# EAGLE design module (EAGLE 9.4.0)
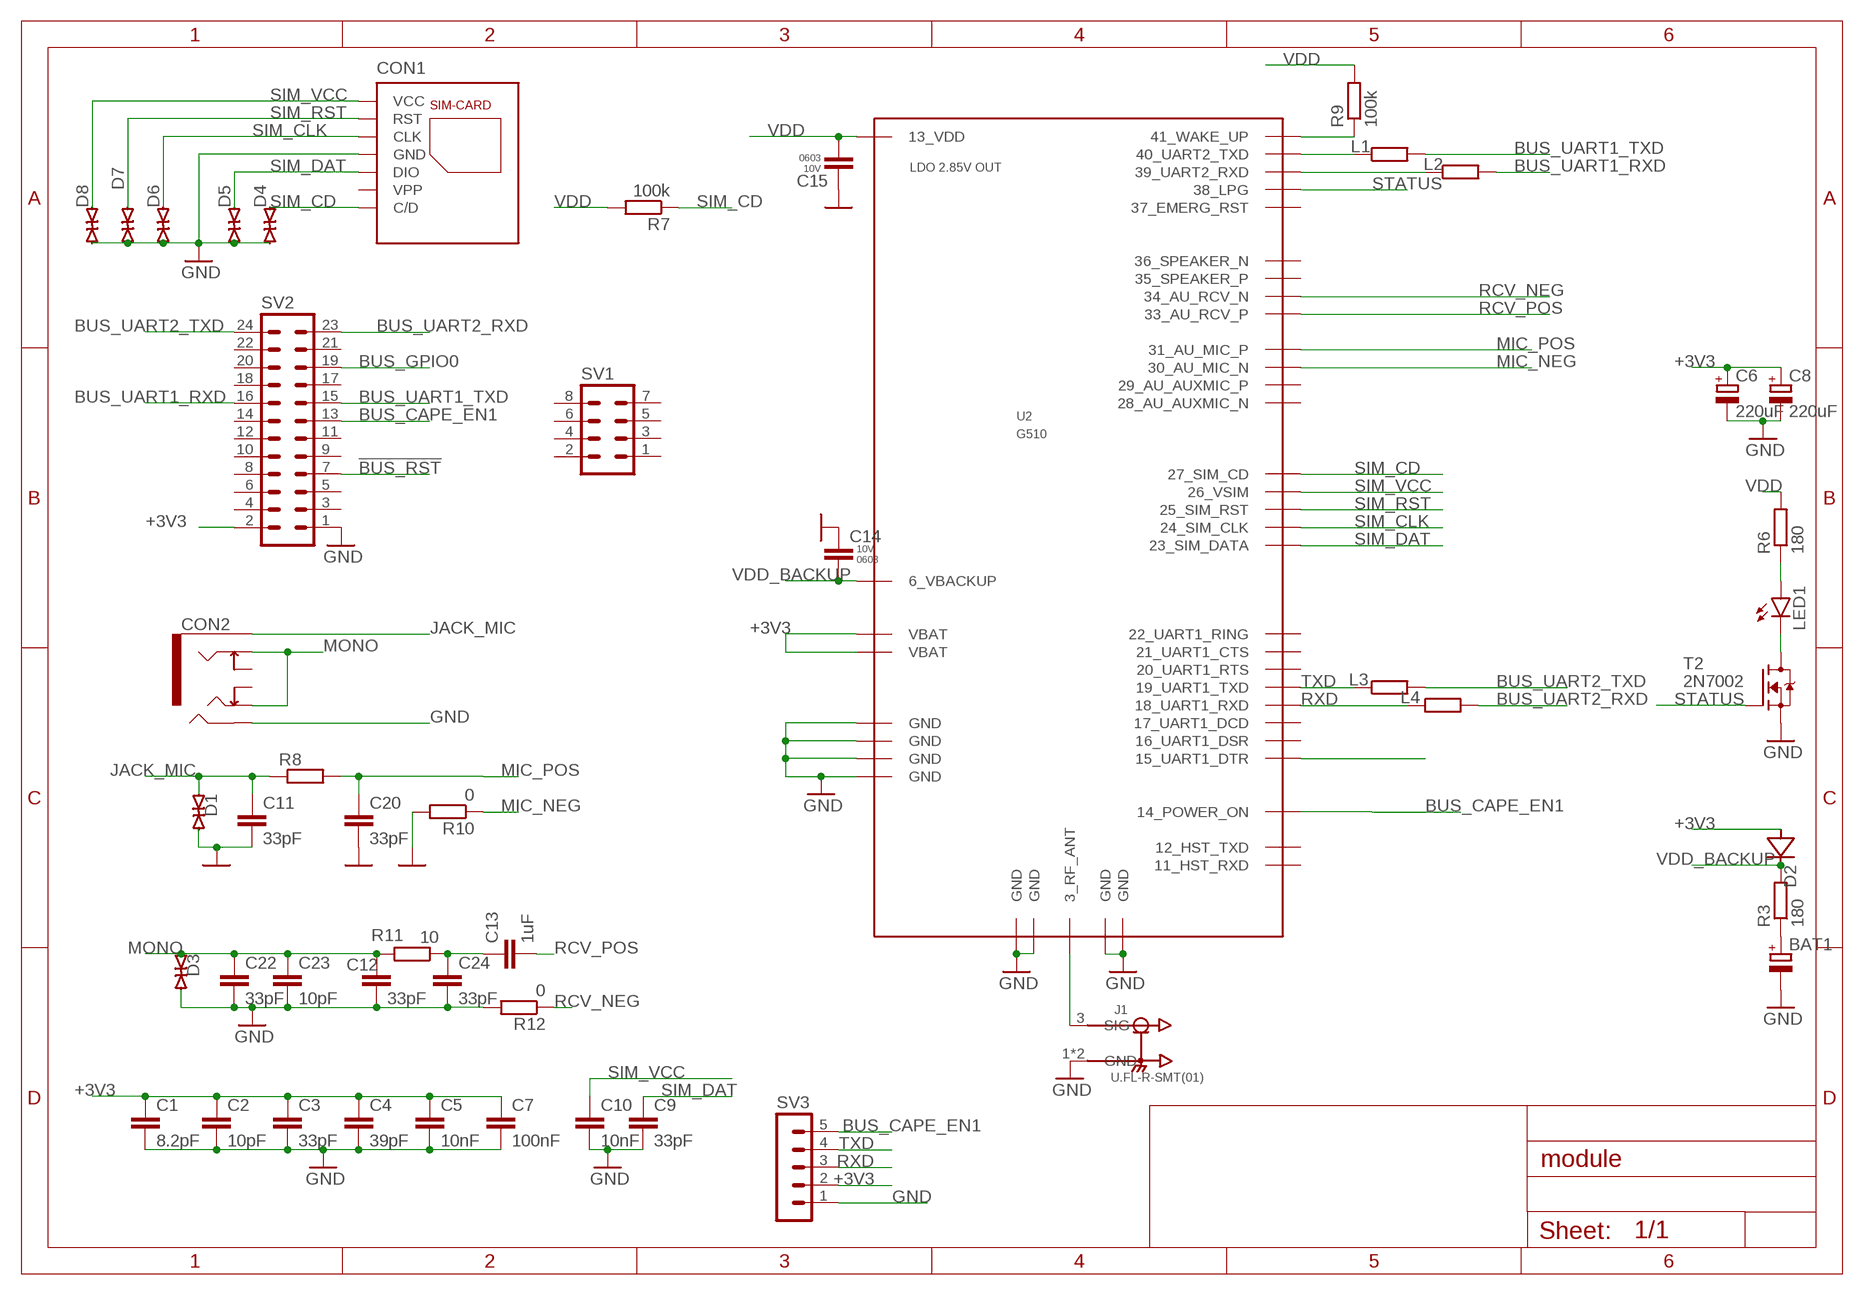
[diagram p0: schematic, sheet 1]

## Parts
BAT1  DCK-3R3E224U-E  [621]
C1  8.2pF  CAP-0402  [C0402K]
C2  10pF  CAP-0402  [C0402K]
C3  33pF  CAP-0402  [C0402K]
C4  39pF  CAP-0402  [C0402K]
C5  10nF  C-EUC0603  [C0603]
C6  220uF  CAP-POL-SMC  [SMC_C]
C7  100nF  C-EUC0603  [C0603]
C8  220uF  CAP-POL-SMC  [SMC_C]
C9  33pF  CAP-0603  [C0603]
C10  10nF  CAP-0603  [C0603]
C11  33pF  CAP-0402  [C0402K]
C12  33pF  CAP-0402  [C0402K]
C13  1uF  CAP-0402  [C0402K]
C14  CAP-0603  [C0603]
C15  CAP-0603  [C0603]
C20  33pF  CAP-0402  [C0402K]
C22  33pF  CAP-0402  [C0402K]
C23  10pF  CAP-0402  [C0402K]
C24  33pF  CAP-0402  [C0402K]
CON1  115Q-BCA0  [115Q]
CON2  1503-21  [150321]
D1  ESD9B5.0ST5G  [SOD1006X40]
D2  1N4148WS  [SOD323]
D3  ESD9B5.0ST5G  [SOD1006X40]
D4  ESD9B5.0ST5G  [SOD1006X40]
D5  ESD9B5.0ST5G  [SOD1006X40]
D6  ESD9B5.0ST5G  [SOD1006X40]
D7  ESD9B5.0ST5G  [SOD1006X40]
D8  ESD9B5.0ST5G  [SOD1006X40]
J1  U.FL-R-SMT(01)  [HRS_U.FL-R-SMT(01)]
L1  RES-0603  [R0603]
L2  RES-0603  [R0603]
L3  RES-0603  [R0603]
L4  RES-0603  [R0603]
LED1  LEDCHIP-LED0603  [CHIP-LED0603]
R3  180  RES-0603  [R0603]
R6  180  RES-0603  [R0603]
R7  100k  RES-0603  [R0603]
R8  R-EU_R0402  [R0402]
R9  100k  RES-0603  [R0603]
R10  0  R-EU_R0402  [R0402]
R11  10  R-EU_R0402  [R0402]
R12  0  R-EU_R0402  [R0402]
SV1  MA04-2  [MA04-2]
SV2  MA12-2  [MA12-2]
SV3  MA05-1  [MA05-1]
T2  2N7002  [SOT95P240X110-3]
U2  G510  [G510]

## Nets
!BUS_RST: SV2.7
+3V3: C1.1 C2.1 C3.1 C4.1 C5.1 C6.+ C7.1 C8.+ D2.A SV2.2 SV3.2 U2.9_VBAT(VBAT) U2.10_VBAT(VBAT)
BUS_CAPE_EN1: SV2.13 SV3.5 U2.14_POWER_ON
BUS_GPIO0: SV2.19
BUS_UART1_RXD: L2.2 SV2.16
BUS_UART1_TXD: L1.2 SV2.15
BUS_UART2_RXD: L4.2 SV2.23
BUS_UART2_TXD: L3.2 SV2.24
GND: BAT1.- C1.2 C2.2 C3.2 C4.2 C5.2 C6.- C7.2 C8.- C9.2 C10.2 C11.2 C12.2 C14.1 C15.1 C20.2 C22.2 C23.2 C24.2 CON1.GND1(GND) CON1.GND2(GND) CON1.GND3(GND) CON1.GND4(GND) CON1.P5(GND) CON2.2 D1.2(C) D3.2(C) D4.1(A) D5.1(A) D6.1(A) D7.1(A) D8.1(A) J1.1(GND) J1.2(GND) R10.2 R12.2 SV2.1 SV3.1 T2.2(S) U2.1_GND(GND) U2.2_GND(GND) U2.4_GND(GND) U2.5_GND(GND) U2.7_GND(GND) U2.8_GND(GND) U2.32_GND(GND) U2.42_GND(GND)
JACK_MIC: C11.1 CON2.1 D1.1(A) R8.1
MIC_NEG: R10.1 U2.30_AU_MIC_N
MIC_POS: C20.1 R8.2 U2.31_AU_MIC_P
MONO: C12.1 C22.1 C23.1 CON2.3 CON2.5 D3.1(A) R11.2
N$1: BAT1.+ R3.1
N$3: C13.1 C24.1 R11.1
N$4: J1.3(SIG) U2.3_RF_ANT
N$5: U2.15_UART1_DTR
N$6: LED1.C T2.3(D)
N$7: R9.1 U2.41_WAKE_UP
N$12: LED1.A R6.1
RCV_NEG: R12.1 U2.34_AU_RCV_N
RCV_POS: C13.2 U2.33_AU_RCV_P
RXD: L4.1 SV3.3 U2.18_UART1_RXD
SIM_CD: CON1.CD(C/D) D4.2(C) R7.1 U2.27_SIM_CD
SIM_CLK: CON1.P3(CLK) D6.2(C) U2.24_SIM_CLK
SIM_DAT: C9.1 CON1.P7(DIO) D5.2(C) U2.23_SIM_DATA
SIM_RST: CON1.P2(RST) D7.2(C) U2.25_SIM_RST
SIM_VCC: C10.1 CON1.P1(VCC) D8.2(C) U2.26_VSIM
STATUS: T2.1(G) U2.38_LPG
TXD: L3.1 SV3.4 U2.19_UART1_TXD
UART_RXD: L2.1 U2.39_UART2_RXD
UART_TXD: L1.1 U2.40_UART2_TXD
VDD: C15.2 R6.2 R7.2 R9.2 U2.13_VDD
VDD_BACKUP: C14.2 D2.K(C) R3.2 U2.6_VBACKUP
Unconnected: CON1.P6(VPP) CON2.4 CON2.6 SV1.1 SV1.2 SV1.3 SV1.4 SV1.5 SV1.6 SV1.7 SV1.8 SV2.3 SV2.4 SV2.5 SV2.6 SV2.8 SV2.9 SV2.10 SV2.11 SV2.12 SV2.14 SV2.17 SV2.18 SV2.20 SV2.21 SV2.22 U2.11_HSTRXD(11_HST_RXD) U2.12_HST_TXD U2.16_UART1_DSR U2.17_UART1_DCD U2.20_UART1_RTS U2.21_UART1_CTS U2.22_UART1_RING U2.28_AU_AUXMIC_N U2.29_AU_AUXMIC_P U2.35_SPEAKER_P U2.36_SPEAKER_N U2.37_EMERG_RST

## Library data of the parts
BAT1 = parts-elna:DCK-3R3E224U-E
C1-C4 C11-C13 C20 C22-C24 = parts-passives:CAP-; PACKAGE: 0402; RATING: 6V
C5 C7 = rcl:C-EU: CAPACITOR, European symbol; SPICEPREFIX: C
C6 C8 = parts-passives:CAP-POL-; PACKAGE: SMC; RATING: 6V
C9 C10 C14 C15 = parts-passives:CAP-; PACKAGE: 0603; RATING: 10V
CON1 = parts-attend:115Q-BCA0
CON2 = parts-lumberg:1503-21
D1 D3-D8 = parts-onsemi:ESD9B
D2 = parts-diotec:1N4148WS
J1 = parts-molex:U.FL-R-SMT(01): U.FL Series 6 Ghz 50 Ohm Ultra-small SMT Coaxial Cable Receptacle; AVAILABILITY: Unavailable; DESCRIPTION: U.FL Series 6 Ghz 50 Ohm Ultra-small SMT Coaxial Cable Receptacle; MF: Hirose; MP: U.FL-R-SMT_01_; PACKAGE: None; PRICE: None
L1-L4 R3 R6 R7 R9 = parts-passives:RES-; PACKAGE: 0603
LED1 = led:LED: LED OSRAM: - CHIPLED LG R971, LG N971, LY N971, LG Q971, LY Q971, LO R971, LY R971 LH N974, LH R974 LS Q976, LO Q976, LY Q976 LO Q996 - Hyper CHIPLED LW Q18S LB Q993, LB Q99A, LB R99A - SideLED LS A670, LO A670, LY A670, LG A670, LP A670 LB A673, LV A673, LT A673, LW A673 LH A674 LY A675 LS A676, LA A676, LO A676, LY A676, LW A676 LS A679, LY A679, LG A679 - Hyper Micro SIDELED® LS Y876, LA Y876, LO Y876, LY Y876 LT Y87S - SmartLED LW L88C, LW L88S LB L89C, LB L89S, LG L890 LS L89K, LO L89K, LY L89K LS L896, LA L896, LO L896, LY L896 - TOPLED LS T670, LO T670, LY T670, LG T670, LP T670 LSG T670, LSP T670, LSY T670, LOP T670, LYG T670 LG T671, LOG T671, LSG T671 LB T673, LV T673, LT T673, LW T673 LH T674 LS T676, LA T676, LO T676, LY T676, LB T676, LH T676, LSB T676, LW T676 LB T67C, LV T67C, LT T67C, LS T67K, LO T67K, LY T67K, LW E67C LS E67B, LA E67B, LO E67B, LY E67B, LB E67C, LV E67C, LT E67C LW T67C LS T679, LY T679, LG T679 LS T770, LO T770, LY T770, LG T770, LP T770 LB T773, LV T773, LT T773, LW T773 LH T774 LS E675, LA E675, LY E675, LS T675 LS T776, LA T776, LO T776, LY T776, LB T776 LHGB T686 LT T68C, LB T68C - Hyper Mini TOPLED® LB M676 - Mini TOPLED Santana® LG M470 LS M47K, LO M47K, LY M47K Source: http://www.osram.convergy.de LUXEON: - LUMILED® LXK2-PW12-R00, LXK2-PW12-S00, LXK2-PW14-U00, LXK2-PW14-V00 LXK2-PM12-R00, LXK2-PM12-S00, LXK2-PM14-U00 LXK2-PE12-Q00, LXK2-PE12-R00, LXK2-PE12-S00, LXK2-PE14-T00, LXK2-PE14-U00 LXK2-PB12-K00, LXK2-PB12-L00, LXK2-PB12-M00, LXK2-PB14-N00, LXK2-PB14-P00, LXK2-PB14-Q00 LXK2-PR12-L00, LXK2-PR12-M00, LXK2-PR14-Q00, LXK2-PR14-R00 LXK2-PD12-Q00, LXK2-PD12-R00, LXK2-PD12-S00 LXK2-PH12-R00, LXK2-PH12-S00 LXK2-PL12-P00, LXK2-PL12-Q00, LXK2-PL12-R00 Source: www.luxeon.com KINGBRIGHT: KA-3528ASYC Source: www.kingbright.com
R8 R10-R12 = rcl:R-EU_: RESISTOR, European symbol; SPICEPREFIX: R
SV1 = con-lstb:MA04-2: PIN HEADER; OC_FARNELL: unknown; OC_NEWARK: unknown
SV2 = con-lstb:MA12-2: PIN HEADER; OC_FARNELL: unknown; OC_NEWARK: unknown
SV3 = parts-passives:MA05-1: PIN HEADER; OC_FARNELL: unknown; OC_NEWARK: unknown
T2 = parts-onsemi:2N7002
U2 = parts-fibocom:G510

## Net classes
1 50_feed: width 1 mm, clearance 0.4 mm
2 usb_dif: width 0.4 mm, clearance 0.8 mm

## Board
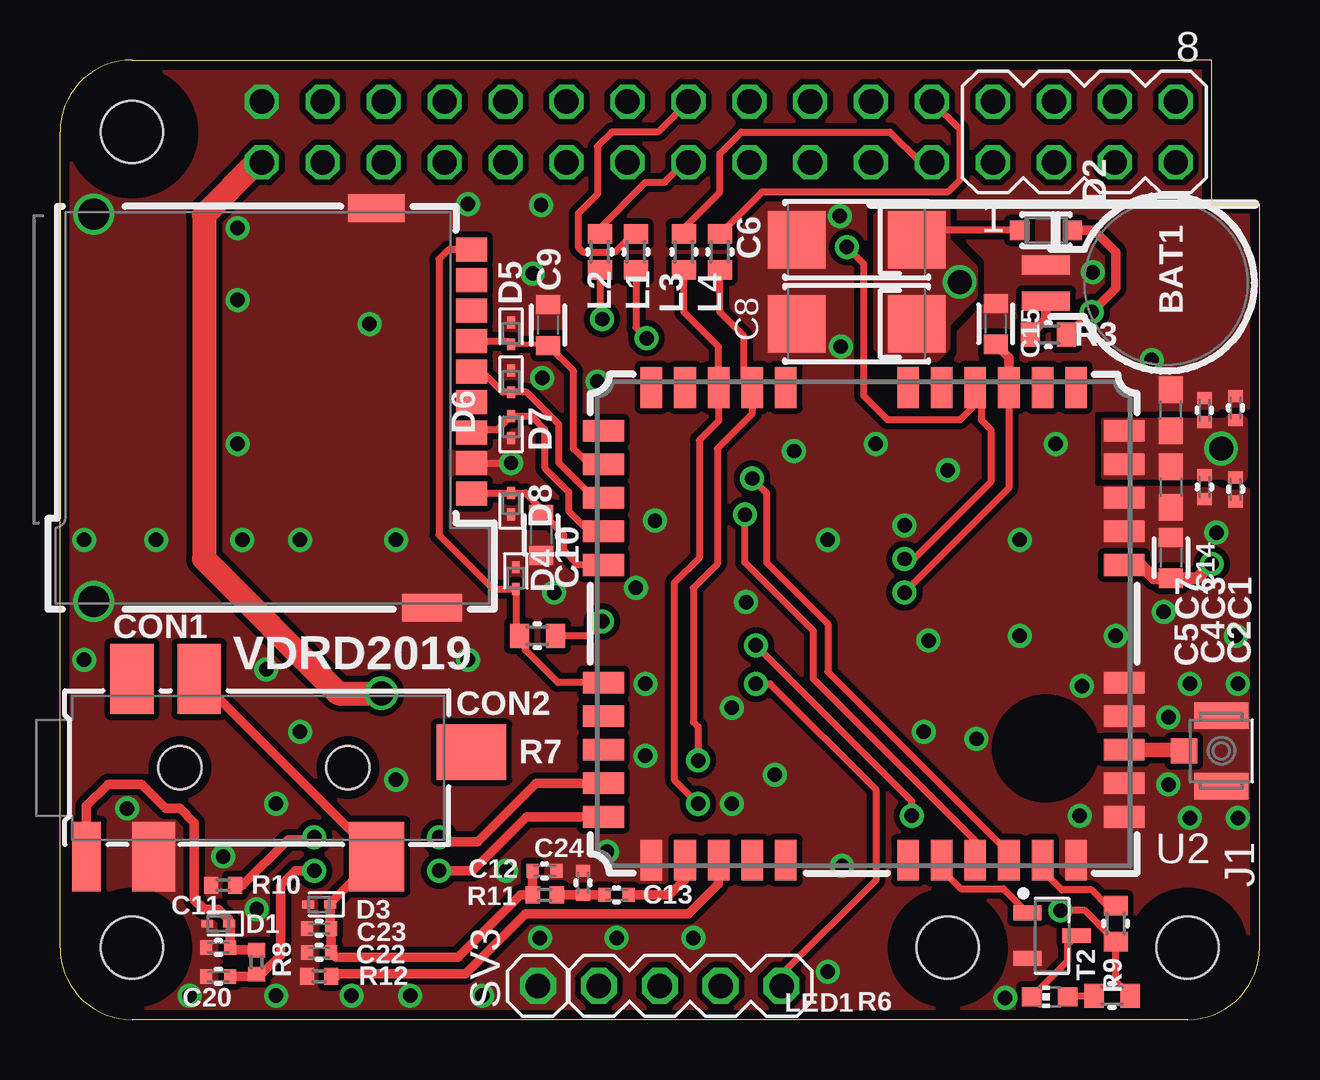
[diagram p1: board, top side]
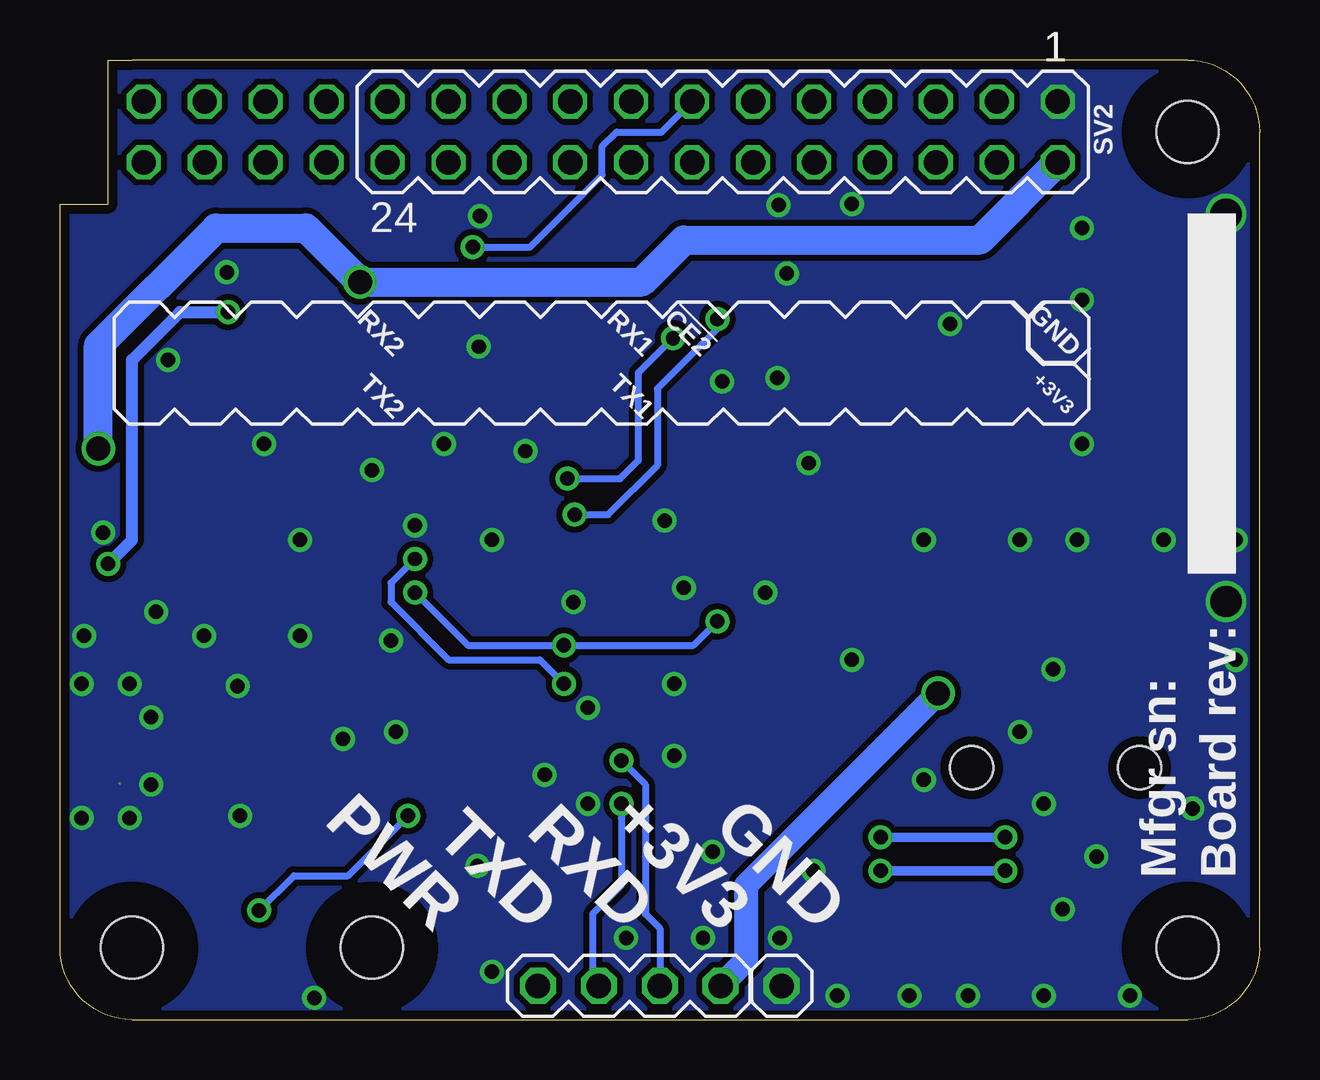
[diagram p2: board, bottom side, seen from below]

Size 50 x 40 mm. Coordinates in mm from the lower left corner, seen from the top.
Outline: 3,40 47,40 48,40 48,34 50,34 50,3 arc-90 47,0 3,0 arc-90 0,3 0,37 arc-90 3,40
Copper layers (1*16): Top 0.035mm / dielectric 0.93mm / Bottom 0.035mm
Design rules "default *": minimum track width 0.2mm, minimum drill 0.3mm, track to track 0.2mm, track to pad 0.2mm, pad to pad 0.2mm, via to via 0.2mm, smd to smd 6mil, copper to edge 0.4mm, drill to drill 0.2mm, minimum pad ring 0.2mm, minimum via ring 0.2mm, stop-mask expansion 0.1mm, vias tented up to drill 0.6mm, thermal gap 10mil
Holes 2.6 mm at 3,37 3,3 37,3 47,3
tRestrict: area 0.5,34.5 to 5.5,39.5; area 0.8,0.8 to 5.2,5.2; area 34.8,0.8 to 39.2,5.2; area 44.8,0.8 to 49.2,5.2
bRestrict: area 0.5,34.5 to 5.5,39.5; area 0.5,0.5 to 5.5,5.5; area 34.5,0.5 to 39.5,5.5; area 44.5,0.5 to 49.5,5.5

### Footprints (pad centres in the part's own frame; a part is rotated, then mirrored left to right if it is on the bottom)
621 = smd 0.8 x 2: + 0.75,-1.6; - -0.75,-1.6
C0402K = smd 0.5 x 0.6: 1 -0.5,0; 2 0.5,0
C0603 = smd 1.1 x 1: 1 -0.85,0; 2 0.85,0
SMC_C = smd 2.4 x 2.4: + -2.5,0; - 2.5,0
C0603' = smd 0.8 x 1: 1 -0.85,0; 2 0.85,0
115Q = smd 1 x 1.3: CD -6.59,0.65; P1 3.57,0.65; P2 1.03,0.65; P3 -1.51,0.65; P4 -4.05,0.65; P5 2.3,0.65; P6 -0.24,0.65; P7 -2.78,0.65; P8 -5.32,0.65 | smd 1.15 x 2.35: GND1 -8.325,-3.32 | smd 1.15 x 2.5: GND2 8.325,-1 | drill 1.3: GND3 -8.07,-15.1; GND4 8.07,-15.1
150321 = smd 1.2 x 2.9: 1 3.9,3.7 | smd 1.8 x 2.9: 2 1.1,3.7; 5 -0.8,-3.7; 6 2,-3.7 | smd 2.3 x 2.9: 3 -8.2,3.7 | smd 2.9 x 2.3: 4 -12.15,-0.65 | hole 1.8: 0,0; -7,0
SOD1006X40 = smd 0.495 x 0.32: 1 -0.453,0; 2 0.453,0
SOD323 = smd 0.8 x 0.8: A 1.1,0; K -1.1,0
HRS_U.FL-R-SMT(01) = smd 1.1 x 2.25: 1 -1.475,0; 2 1.475,0 | smd 1.05 x 1.1: 3 0,-1.55
R0603 = smd 0.8 x 1: 1 -0.75,0; 2 0.75,0
CHIP-LED0603 = smd 0.8 x 0.8: A 0,-0.75; C 0,0.75
R0402 = smd 0.6 x 0.7: 1 -0.5,0; 2 0.5,0
MA04-2 = drill 1.016 octagon: 1 -3.81,-1.27; 2 -3.81,1.27; 3 -1.27,-1.27; 4 -1.27,1.27; 5 1.27,-1.27; 6 1.27,1.27; 7 3.81,-1.27; 8 3.81,1.27
MA12-2 = drill 1.016 octagon: 1 -13.97,-1.27; 2 -13.97,1.27; 3 -11.43,-1.27; 4 -11.43,1.27; 5 -8.89,-1.27; 6 -8.89,1.27; 7 -6.35,-1.27; 8 -6.35,1.27; 9 -3.81,-1.27; 10 -3.81,1.27; 11 -1.27,-1.27; 12 -1.27,1.27; 13 1.27,-1.27; 14 1.27,1.27; 15 3.81,-1.27; 16 3.81,1.27; 17 6.35,-1.27; 18 6.35,1.27; 19 8.89,-1.27; 20 8.89,1.27; 21 11.43,-1.27; 22 11.43,1.27; 23 13.97,-1.27; 24 13.97,1.27
MA05-1 = drill 1.016 pad 1.5 octagon: 1 -5.08,0; 2 -2.54,0; 3 0,0; 4 2.54,0; 5 5.08,0
SOT95P240X110-3 = smd 1.18 x 0.609: 1 -1.024,0.95; 2 -1.024,-0.95; 3 1.024,0
G510 = smd 0.9 x 1.7: 1_GND -8.05,-10.85; 2_GND -6.65,-10.85; 3_RF_ANT -5.25,-10.85; 4_GND -3.85,-10.85; 5_GND -2.45,-10.85; 6_VBACKUP 2.45,-10.85; 7_GND 3.85,-10.85; 8_GND 5.25,-10.85; 9_VBAT 6.65,-10.85; 10_VBAT 8.05,-10.85; 22_UART1_RING 8.05,10.85; 23_SIM_DATA 6.65,10.85; 24_SIM_CLK 5.25,10.85; 25_SIM_RST 3.85,10.85; 26_VSIM 2.45,10.85; 27_SIM_CD -2.45,10.85; 28_AU_AUXMIC_N -3.85,10.85; 29_AU_AUXMIC_P -5.25,10.85; 30_AU_MIC_N -6.65,10.85; 31_AU_MIC_P -8.05,10.85 | smd 1.7 x 0.9: 11_HSTRXD 9.85,-8.85; 12_HST_TXD 9.85,-7.45; 13_VDD 9.85,-6.05; 14_POWER_ON 9.85,-4.65; 15_UART1_DTR 9.85,-3.25; 16_UART1_DSR 9.85,-1.85; 17_UART1_DCD 9.85,3.25; 18_UART1_RXD 9.85,4.65; 19_UART1_TXD 9.85,6.05; 20_UART1_RTS 9.85,7.45; 21_UART1_CTS 9.85,8.85; 32_GND -9.85,8.85; 33_AU_RCV_P -9.85,7.45; 34_AU_RCV_N -9.85,6.05; 35_SPEAKER_P -9.85,4.65; 36_SPEAKER_N -9.85,3.25; 37_EMERG_RST -9.85,-1.85; 38_LPG -9.85,-3.25; 39_UART2_RXD -9.85,-4.65; 40_UART2_TXD -9.85,-6.05; 41_WAKE_UP -9.85,-7.45; 42_GND -9.85,-8.85

### Placement (x,y rotation side)
BAT1  42.7,30.7 270 top
C1  49,25.5 90 top
C2  49,22.1 270 top
C3  47.7,25.4 90 top
C4  47.7,22.2 270 top
C5  46.3,22.2 270 top
C6  33.2,32.5 180 top
C7  46.3,25.4 90 top
C8  33.2,29 180 top
C9  33pF  [C0603']  20.35,28.95 90 top
C10  10nF  [C0603']  20.05,20.2 270 top
C11  6.6,3 180 top
C12  20.2,6.2 0 top
C13  23.2,5.2 0 top
C14  [C0603']  46.3,19.25 270 top
C15  [C0603']  39,29 270 top
C20  6.6,1.8 180 top
C22  10.8,2.8 180 top
C23  10.8,3.8 180 top
C24  21.8,5.7 90 top
CON1  16.5,25.5 270 top
CON2  5,10.5 180 top
D1  6.6,4 180 top
D2  41.1,32.9 180 top
D3  10.8,4.8 180 top
D4  19,18.4 270 top
D5  18.8,28.6 270 top
D6  18.8,26.6 270 top
D7  18.8,24.7 90 top
D8  18.8,21.5 90 top
J1  48.4,11.2 270 top
L1  24,32 90 top
L2  22.5,32 90 top
L3  26,32 90 top
L4  27.5,32 90 top
LED1  41.25,0.95 90 top
R3  41.2,28.55 0 top
R6  43.85,1 0 top
R7  19.9,16 0 top
R8  8.2,2.4 270 top
R9  44,4 270 top
R10  6.8,5.6 180 top
R11  20.2,5.2 180 top
R12  10.8,1.8 180 top
SV1  42.7,37 0 top
SV2  22.38,37 180 bottom
SV3  25,1.4 0 top
T2  41.35,3.5 0 top
U2  33.5,16.5 90 top

### Tracks (layer width: path | path; a pad name or v marks a point on that pad's centre or on a via)
+3V3  (via drill 1)
  Top 0.3: D2.A 36.1,32.9 C6.+
  Top 1: SV2.2 8.2,35.73 6,33.53 6,19.2 11.6,13.6 v13.4,13.6
  Bottom 1: v13.4,13.6 21.4,5.6 21.4,2.46 SV3.2
  Bottom 1.2: v48.4,23.8 48.4,28.1 43.5,33 39.75,33 v37.5,30.75 25.75,30.75 24,32.5 11.64,32.5 SV2.2
  pour Top (no thermals): 43.5,25 48.6,25 48.7,25.1 49.3,25.1 49.4,25 49.4,22.6 49.3,22.5 48.7,22.5 48.6,22.6 43.5,22.6
  pour Top (no thermals): 34.5,27.5 34,28 34,33.5 34.5,34 37,34 37,32.5 38.15,31.35 38.15,30.15 37,29 37,28 36.5,27.5
BUS_CAPE_EN1  (via drill 0.6)
  Top 0.2: U2.14_POWER_ON 38.4,26.1
  Top 0.3: U2.14_POWER_ON 38,26.2 38,25.5 37.5,25 34.5,25 33.5,26 33.5,31.5 v32.8,32.2 | v35.2,19.2 35.6,19.2 38.8,22.4 38.8,24.6 38.4,25 38.4,26.1 | v29,14 29.6,14 34,9.6 34,5.8 30.08,1.88 SV3.5
  Bottom 0.3: v32.8,32.2 30.4,32.2 27.4,35.2 27.4,36.4 26.8,37 24.92,37 SV2.13 | v35.2,19.2 36.2,18.2 36.2,17.4 33.8,15 30,15 v29,14
BUS_UART1_RXD
  Top 0.3: L2.2 22.5,33 24.4,34.9 25.2,34.9 26.03,35.73 SV2.16
BUS_UART1_TXD
  Top 0.3: SV2.15 24.92,37 23,37 22.4,36.4 22.4,34.4 21.6,33.6 21.6,32.2 21.8,32 23.14,32 23.89,32.75 L1.2
BUS_UART2_RXD
  Top 0.3: SV2.23 37.5,37.12 37.5,35 37,34.5 29.25,34.5 L4.2
BUS_UART2_TXD
  Top 0.3: SV2.24 35.87,35.73 34.6,37 28.4,37 27.5,36.1 27.5,34.5 26,33 L3.2
GND  (via drill 0.6)
  Top 0.3: CON1.P5 v18.8,23.2
  other vias: 22.4,26.6 19.7,31.1 34,24 32.55,28.05 32.5,33.5 30.6,23.7 48.2,20.3 49.1,14 47.1,14 46.2,12.6 42.6,13.9 38.2,11.7 46.2,9.8 49.1,8.4 47.1,8.4 41.5,24 37,22.9 4,20 5.4,1 9,1 12.15,1 14.6,1 17.6,1 23.2,3.4 42.5,8.5 39.4,0.9 32,2 44,16 49,16 40,16 36.2,15.8 36,12 40,20 46,17 35.2,20.6 32,20 24.8,20.8 28.6,17.4 24,18 24.4,11 22.8,7 28,9 29.8,10.2 28,13 24.4,14 26.4,3.4 20,3.4 18.6,6.2 14,10 10,12 9,9 6.8,6.8 2.8,8.8 1,15 1,20 7.6,20 14,20 10,20 17,15 8.6,14.6 7.4,24 7.4,30 7.4,33 12.9,29 17,34 20.05,33.95 43.05,31.15 20.1,26.75 8.2,4.6 32.6,6.4 45.5,27.5 20.6,17.8
  pour Top (isolate 0.25, rank 6, no thermals): -1,41 51,41 51,-1 -1,-1
  pour Bottom (isolate 0.25, rank 6, no thermals): -2,42 -2,-2 52,-2 52,42
JACK_MIC
  Top 0.4: CON2.1 1.1,8.9 2,9.8 3.4,9.8 4.4,8.8 5,8.8 5.6,8.2 5.6,5 6,4.6 6.6,4.6 7.05,4.15 D1.1 7.1,3.95 C11.1 7.2,2.9 R8.1
MIC_NEG  (via drill 0.6)
  Top 0.4: U2.30_AU_MIC_N 19.85,9.85 17.4,7.4 16,7.4 v15.8,7.6 | R10.1 7.6,5.6 9.5,7.5 10.5,7.5 v10.6,7.6
  Bottom 0.4: v15.8,7.6 v10.6,7.6
MIC_POS  (via drill 0.6)
  Top 0.4: C20.1 8.1,1.8 R8.2 8.42,1.9 9.2,2.68 9.2,5.6 9.8,6.2 v10.6,6.2 | U2.31_AU_MIC_P 19.45,8.45 17.2,6.2 v15.8,6.2
  Bottom 0.4: v15.8,6.2 v10.6,6.2
MONO
  Top 0.4: CON2.5 CON2.3 11.25,4.85 D3.1 11.25,3.85 C23.1 C22.1 11.5,2.6 16.6,2.6 19.2,5.2 R11.2 C12.1
N$1
  Top 0.4: R3.1 41.1,29.2 BAT1.+
N$3
  Top 0.4: C13.1 C24.1 R11.1
N$4
  Top 0.6: U2.3_RF_ANT 46.8,11.25 J1.3
N$6
  Top 0.3: LED1.C 42,2.45 42,3.13 T2.3
N$7
  Top 0.3: R9.1 43.65,4.75 43,5.4 41.75,5.4 40.95,6.2 U2.41_WAKE_UP
N$12
  Top 0.3: LED1.A 42.05,1 R6.1
RCV_NEG
  Top 0.4: U2.34_AU_RCV_N 27.45,5.65 26.2,4.4 19.4,4.4 16.9,1.9 11.63,1.9 11.53,1.8 R12.1
RCV_POS
  Top 0.4: U2.33_AU_RCV_P 26.05,5.85 25.4,5.2 C13.2
RXD  (via drill 0.6)
  Top 0.3: L4.1 27.5,29.5 28.5,28.5 28.5,26.7 U2.18_UART1_RXD 28.85,25.25 27.4,23.8 27.4,19 26.4,18 26.4,12.4 26.6,12.2 v26.6,10.8
  Bottom 0.3: v26.6,10.8 25.6,9.8 25.6,4.4 25,3.8 SV3.3
SIM_CD
  Top 0.3: CON1.CD 16.19,32.09 15.8,31.7 15.8,20.2 18.05,17.95 D4.2 19,16.15 19.1,16.05 R7.1 19.4,15.4 20.75,14.05 U2.27_SIM_CD
SIM_CLK
  Top 0.3: U2.24_SIM_CLK 22.25,21.75 20.8,23.2 20.8,24.8 19.45,26.15 D6.2 18.45,26.15 17.59,27.01 CON1.P3
SIM_DAT
  Top 0.2: D5.2 20.3,28.15 C9.1
  Top 0.3: CON1.P7 18.67,28.28 D5.2 | U2.23_SIM_DATA 22.05,23.15 21.4,23.8 21.4,27 21.4,27.05 C9.1
SIM_RST
  Top 0.3: CON1.P2 17.28,24.6 18.25,24.6 D7.2 19.65,25.15 20.2,24.6 20.2,23 21.2,22 21.2,21.2 22.05,20.35 U2.25_SIM_RST
SIM_VCC
  Top 0.3: 22.25,18.95 U2.26_VSIM 21.6,18.95 21,19.55 21,20.2 20.15,21.05 C10.1 20.05,21.3 19.4,21.95 D8.2 17.17,21.95 CON1.P1
STATUS
  Top 0.3: U2.38_LPG 36.75,6.25 37.55,5.45 39.33,5.45 T2.1
TXD  (via drill 0.6)
  Top 0.3: L3.1 26,29.5 27.45,28.05 U2.19_UART1_TXD 27.45,24.95 26.65,24.15 26.65,19.25 25.6,18.2 25.6,10 v26.6,9
  Bottom 0.3: v26.6,9 26.6,8.4 26.6,5.6 27.8,4.4 27.8,1.66 SV3.4
UART_RXD  (via drill 0.6)
  Top 0.3: U2.39_UART2_RXD 38.15,7.45 31.4,14.2 31.4,16.2 28.55,19.05 v28.55,21.05 | L2.1 22.5,29.3 v22.6,29.2
  Bottom 0.3: v28.55,21.05 27.15,21.05 25.1,23.1 25.1,26.3 22.6,28.8 v22.6,29.2
UART_TXD  (via drill 0.6)
  Top 0.3: U2.40_UART2_TXD 39.55,6.95 32,14.5 32,16.5 29.45,19.05 29.45,21.95 v28.85,22.55 | L1.1 24,28.85 v24.45,28.4
  Bottom 0.3: v28.85,22.55 26.65,22.55 25.9,23.3 25.9,26.95 v24.45,28.4
VDD  (via drill 0.6)
  Top 0.3: U2.13_VDD 39.55,22.15 v35.2,17.8 | 21,16 R7.2 22,16 v22.6,16.6 | R6.2 44,1.6 R9.2 43.31,3.94 43.31,3.95 42.71,4.55 v41.7,4.55 | v35.5,8.5 35.5,9.1 v29,15.6
  Top 0.4: U2.13_VDD 39.55,27.6 C15.2
  Bottom 0.3: v35.2,17.8 33,15.6 v29,15.6 23.6,15.6 v22.6,16.6 | v41.7,4.55 40.25,6 38,6 v35.5,8.5
VDD_BACKUP  (via drill 0.6)
  Top 0.4: D2.K 43.1,32.9 44,32 44,30.5 v43,29.5 42.05,28.55 R3.2
  Top 0.5: U2.6_VBACKUP 45.05,18.95 45.6,18.4 C14.2 47.4,18.4 v48,19
  Bottom 0.5: v48,19 47,20 47,27.5 45,29.5 v43,29.5

### Text on the board
bPlace: GND | !CE2 | RX1 | RX2 | +3V3 | TX1 | TX2
tNames: VDRD2019
bNames: Board rev: | Mfgr sn: | GND | +3V3 | RXD | TXD | PWR
Measures: x4 | x4